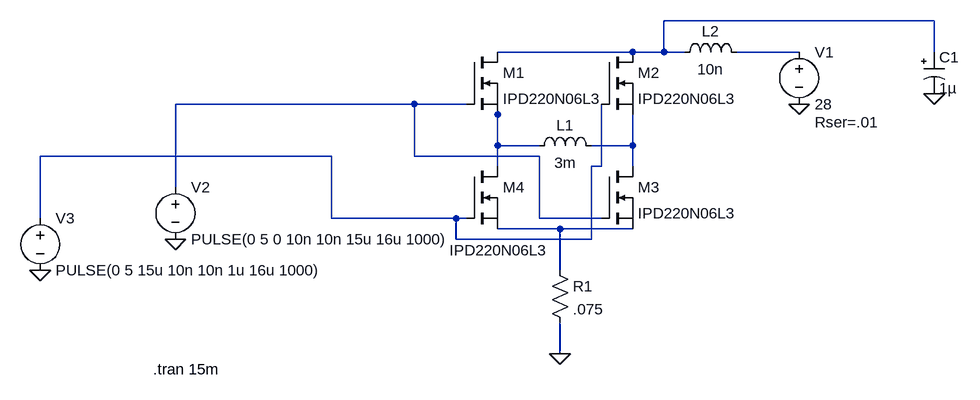
[diagram p0: schematic hbridge.asc]
hbridge.asc, the LTspice schematic file:
Version 4
SHEET 1 976 680
WIRE 896 -16 480 -16
WIRE 432 32 224 32
WIRE 480 32 480 -16
WIRE 480 32 432 32
WIRE 512 32 480 32
WIRE 688 32 592 32
WIRE 896 32 896 -16
WIRE 96 112 -272 112
WIRE 176 112 96 112
WIRE 224 128 224 112
WIRE 224 176 224 128
WIRE 288 176 224 176
WIRE 432 176 432 128
WIRE 432 176 368 176
WIRE -32 192 -480 192
WIRE 96 192 96 112
WIRE 288 192 96 192
WIRE 224 208 224 176
WIRE 384 208 384 112
WIRE 384 208 368 208
WIRE 432 208 432 176
WIRE -272 240 -272 112
WIRE -480 288 -480 192
WIRE -32 288 -32 192
WIRE 160 288 -32 288
WIRE 176 288 160 288
WIRE 288 288 288 192
WIRE 384 288 288 288
WIRE 320 304 224 304
WIRE 432 304 320 304
WIRE 160 320 160 288
WIRE 368 320 368 208
WIRE 368 320 160 320
WIRE 320 368 320 304
WIRE 320 496 320 448
FLAG 320 496 0
FLAG 688 112 0
FLAG -272 320 0
FLAG 896 96 0
FLAG -480 368 0
SYMBOL nmos 176 32 R0
SYMATTR InstName M1
SYMATTR Value IPD220N06L3
SYMBOL nmos 384 32 R0
SYMATTR InstName M2
SYMATTR Value IPD220N06L3
SYMBOL nmos 384 208 R0
SYMATTR InstName M3
SYMATTR Value IPD220N06L3
SYMBOL nmos 176 208 R0
WINDOW 3 -26 129 Left 2
SYMATTR InstName M4
SYMATTR Value IPD220N06L3
SYMBOL ind 272 192 R270
WINDOW 0 32 56 VTop 2
WINDOW 3 5 56 VBottom 2
SYMATTR InstName L1
SYMATTR Value 3m
SYMATTR SpiceLine Ipk=2 Rser=2.25
SYMBOL res 304 352 R0
SYMATTR InstName R1
SYMATTR Value .075
SYMATTR SpiceLine pwr=2
SYMBOL voltage 688 16 R0
WINDOW 123 0 0 Left 2
WINDOW 39 24 124 Left 2
SYMATTR InstName V1
SYMATTR Value 28
SYMATTR SpiceLine Rser=.01
SYMBOL voltage -272 224 R0
WINDOW 123 0 0 Left 2
WINDOW 39 0 0 Left 2
SYMATTR InstName V2
SYMATTR Value PULSE(0 5 0 10n 10n 15u 16u 1000)
SYMBOL polcap 880 32 R0
WINDOW 3 24 56 Left 2
SYMATTR InstName C1
SYMATTR Value 1µ
SYMATTR Description Capacitor
SYMATTR Type cap
SYMATTR SpiceLine V=100 Irms=1.33 Rser=0.047 Lser=0
SYMBOL voltage -480 272 R0
WINDOW 123 0 0 Left 2
WINDOW 39 0 0 Left 2
SYMATTR InstName V3
SYMATTR Value PULSE(0 5 15u 10n 10n 1u 16u 1000)
SYMBOL ind 496 48 R270
WINDOW 0 32 56 VTop 2
WINDOW 3 5 56 VBottom 2
SYMATTR InstName L2
SYMATTR Value 10n
TEXT -306 520 Left 2 !.tran 15m

The netlist it stands for:
* hbridge.asc
M1 N001 N003 N004 N004 IPD220N06L3
M2 N001 N006 N005 N005 IPD220N06L3
M3 N005 N003 N007 N007 IPD220N06L3
M4 N004 N006 N007 N007 IPD220N06L3
L1 N004 N005 3m Ipk=2 Rser=2.25
R1 N007 0 .075 pwr=2
V1 N002 0 28 Rser=.01
V2 N003 0 PULSE(0 5 0 10n 10n 15u 16u 1000)
C1 N001 0 1µ V=100 Irms=1.33 Rser=0.047 Lser=0
V3 N006 0 PULSE(0 5 15u 10n 10n 1u 16u 1000)
L2 N001 N002 10n
.model NMOS NMOS
.model PMOS PMOS
.lib standard.mos
.tran 15m
.backanno
.end